# Altium schematic sheet SCH_capt_inf.SchDoc
size A4
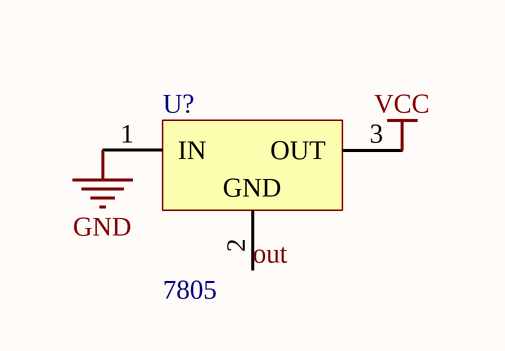
[diagram p0: SCH_capt_inf.SchDoc]

## Parts
U?  7805  [SOT23_N]

## Nets
GND: U?.1(IN)
VCC: U?.3(OUT)
out: U?.2(GND)

## Library data of the parts
U? = LM7805: 3-Terminal Positive 5V Regulator; Manufacturer: FAIRCHILD SEMICONDUCTOR; Manufacturer Part Number: LM7805CT; Package Information: Latest Revision: 2000; Tension d'entrée primaire: 10; Tension de sortie fixe: 5; Tension, déclenchement: 2; Nombre de canaux de sortie: 1; Nombre de broches: 3; Type de boîtier CI régulateur de tension: TO-220; Température de fonctionnement: -40°C à +125; SVHC: No SVHC (20-Jun-2011); Précision: 4%; Température de fonctionnement max..: 125; Température d'utilisation min: -40; Tension, alimentation max..: 20; Tension, alimentation min.: 7; Tension, entrée max..: 35; Type de packaging: Tube; Type de régulation de tension: Positive Adjustable Regulator; Type de terminaison: Traversant; Published: 15-Apr-2002; Datasheet: Latest Revision: Sep-1999; Package Reference: Z03A; Publisher: Altium Limited; ComponentLink1URL: http://www.fairchildsemi.com/ds/LM/LM7812.pdf; ComponentLink1Description: Datasheet; Supplier 1: Farnell; Supplier Part Number 1: 1523798; RoHS: YES; Stock 1: 791; Pricing 1: 50=0,33, 150=0,24, 250=0,161, 500=0,14744 (EUR); Courant, sortie: 1; Courant, sortie max.: 1; Numéro de la fonction logique: 7805; Numéro générique: 7805; Racine de la référence: 7805; Tension, sortie: 5; Tension, sortie max..: 5; Tolérance, tension de fonctionnement +: 4%; Type de boîtier: TO-220; ComponentLink2URL: http://www.farnell.com/datasheets/94418.pdf; ComponentLink2Description: http://www.farnell.com/datasheets/94418.pdf; ComponentLink3URL: http://www.farnell.com/datasheets/410597.pdf; ComponentLink3Description: http://www.farnell.com/datasheets/410597.pdf